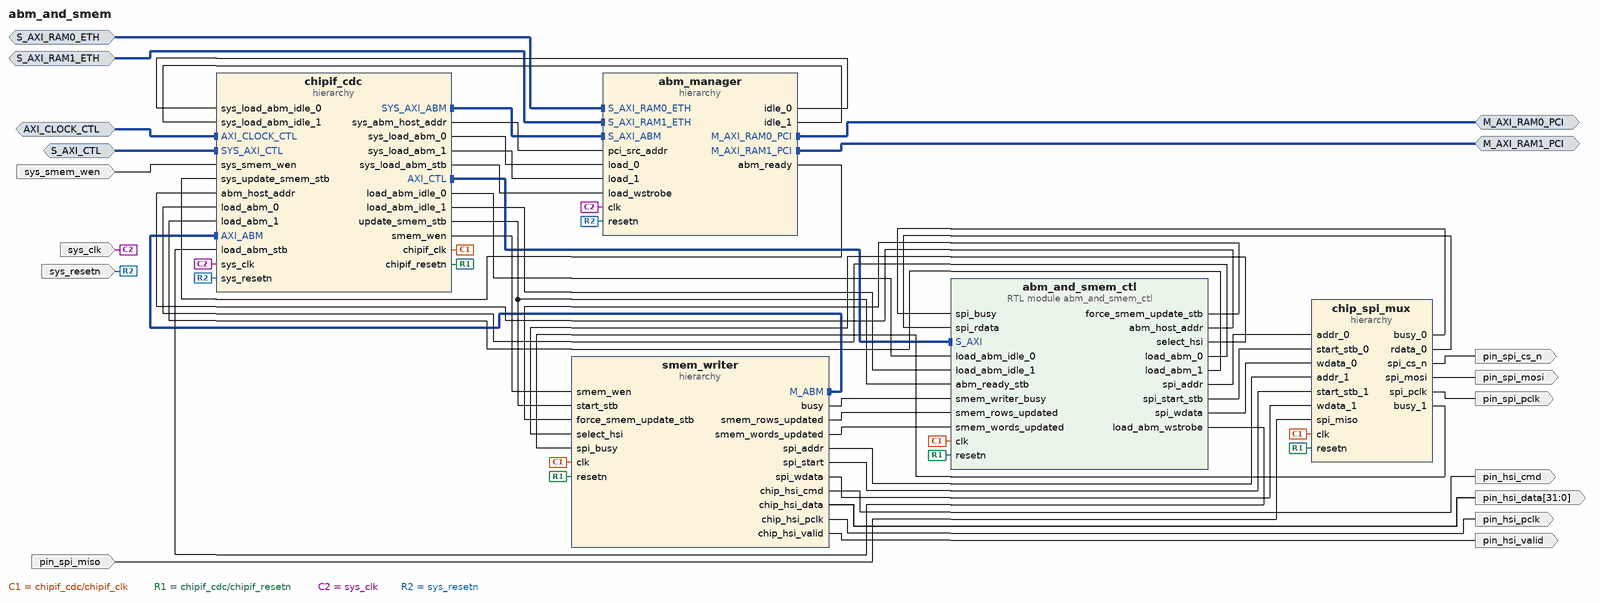
[diagram p0: block diagram of the top level]
# Vivado block design abm_and_smem, xcku15p-ffve1517-3-e, Vivado 2024.2
create_bd_design abm_and_smem

create_bd_intf_port -mode Slave -vlnv xilinx.com:interface:aximm_rtl:1.0 S_AXI_RAM0_ETH
set_property -dict [list \
  CONFIG.ADDR_WIDTH 64 \
  CONFIG.ARUSER_WIDTH 0 \
  CONFIG.AWUSER_WIDTH 0 \
  CONFIG.BUSER_WIDTH 0 \
  CONFIG.DATA_WIDTH 512 \
  CONFIG.FREQ_HZ 250000000 \
  CONFIG.HAS_BRESP 1 \
  CONFIG.HAS_BURST 1 \
  CONFIG.HAS_CACHE 1 \
  CONFIG.HAS_LOCK 1 \
  CONFIG.HAS_PROT 1 \
  CONFIG.HAS_QOS 1 \
  CONFIG.HAS_REGION 0 \
  CONFIG.HAS_RRESP 1 \
  CONFIG.HAS_WSTRB 1 \
  CONFIG.ID_WIDTH 4 \
  CONFIG.MAX_BURST_LENGTH 256 \
  CONFIG.NUM_READ_OUTSTANDING 2 \
  CONFIG.NUM_READ_THREADS 1 \
  CONFIG.NUM_WRITE_OUTSTANDING 2 \
  CONFIG.NUM_WRITE_THREADS 1 \
  CONFIG.PROTOCOL AXI4 \
  CONFIG.READ_WRITE_MODE READ_WRITE \
  CONFIG.RUSER_BITS_PER_BYTE 0 \
  CONFIG.RUSER_WIDTH 0 \
  CONFIG.SUPPORTS_NARROW_BURST 1 \
  CONFIG.WUSER_BITS_PER_BYTE 0 \
  CONFIG.WUSER_WIDTH 0 \
] [get_bd_intf_ports S_AXI_RAM0_ETH]
create_bd_intf_port -mode Master -vlnv xilinx.com:interface:aximm_rtl:1.0 M_AXI_RAM0_PCI
set_property -dict [list \
  CONFIG.ADDR_WIDTH 64 \
  CONFIG.DATA_WIDTH 512 \
  CONFIG.FREQ_HZ 250000000 \
  CONFIG.HAS_REGION 0 \
  CONFIG.NUM_READ_OUTSTANDING 2 \
  CONFIG.NUM_WRITE_OUTSTANDING 2 \
  CONFIG.PROTOCOL AXI4 \
] [get_bd_intf_ports M_AXI_RAM0_PCI]
create_bd_intf_port -mode Slave -vlnv xilinx.com:interface:aximm_rtl:1.0 S_AXI_RAM1_ETH
set_property -dict [list \
  CONFIG.ADDR_WIDTH 64 \
  CONFIG.ARUSER_WIDTH 0 \
  CONFIG.AWUSER_WIDTH 0 \
  CONFIG.BUSER_WIDTH 0 \
  CONFIG.DATA_WIDTH 512 \
  CONFIG.FREQ_HZ 250000000 \
  CONFIG.HAS_BRESP 1 \
  CONFIG.HAS_BURST 1 \
  CONFIG.HAS_CACHE 1 \
  CONFIG.HAS_LOCK 1 \
  CONFIG.HAS_PROT 1 \
  CONFIG.HAS_QOS 1 \
  CONFIG.HAS_REGION 0 \
  CONFIG.HAS_RRESP 1 \
  CONFIG.HAS_WSTRB 1 \
  CONFIG.ID_WIDTH 4 \
  CONFIG.MAX_BURST_LENGTH 256 \
  CONFIG.NUM_READ_OUTSTANDING 2 \
  CONFIG.NUM_READ_THREADS 1 \
  CONFIG.NUM_WRITE_OUTSTANDING 2 \
  CONFIG.NUM_WRITE_THREADS 1 \
  CONFIG.PROTOCOL AXI4 \
  CONFIG.READ_WRITE_MODE READ_WRITE \
  CONFIG.RUSER_BITS_PER_BYTE 0 \
  CONFIG.RUSER_WIDTH 0 \
  CONFIG.SUPPORTS_NARROW_BURST 1 \
  CONFIG.WUSER_BITS_PER_BYTE 0 \
  CONFIG.WUSER_WIDTH 0 \
] [get_bd_intf_ports S_AXI_RAM1_ETH]
create_bd_intf_port -mode Master -vlnv xilinx.com:interface:aximm_rtl:1.0 M_AXI_RAM1_PCI
set_property -dict [list \
  CONFIG.ADDR_WIDTH 64 \
  CONFIG.DATA_WIDTH 512 \
  CONFIG.FREQ_HZ 250000000 \
  CONFIG.HAS_REGION 0 \
  CONFIG.NUM_READ_OUTSTANDING 2 \
  CONFIG.NUM_WRITE_OUTSTANDING 2 \
  CONFIG.PROTOCOL AXI4 \
] [get_bd_intf_ports M_AXI_RAM1_PCI]
create_bd_intf_port -mode Slave -vlnv xilinx.com:interface:aximm_rtl:1.0 AXI_CLOCK_CTL
set_property -dict [list \
  CONFIG.ADDR_WIDTH 16 \
  CONFIG.ARUSER_WIDTH 0 \
  CONFIG.AWUSER_WIDTH 0 \
  CONFIG.BUSER_WIDTH 0 \
  CONFIG.DATA_WIDTH 32 \
  CONFIG.FREQ_HZ 250000000 \
  CONFIG.HAS_BRESP 1 \
  CONFIG.HAS_BURST 0 \
  CONFIG.HAS_CACHE 0 \
  CONFIG.HAS_LOCK 0 \
  CONFIG.HAS_PROT 1 \
  CONFIG.HAS_QOS 0 \
  CONFIG.HAS_REGION 0 \
  CONFIG.HAS_RRESP 1 \
  CONFIG.HAS_WSTRB 1 \
  CONFIG.ID_WIDTH 0 \
  CONFIG.NUM_READ_OUTSTANDING 1 \
  CONFIG.NUM_READ_THREADS 1 \
  CONFIG.NUM_WRITE_OUTSTANDING 1 \
  CONFIG.NUM_WRITE_THREADS 1 \
  CONFIG.PROTOCOL AXI4LITE \
  CONFIG.READ_WRITE_MODE READ_WRITE \
  CONFIG.RUSER_BITS_PER_BYTE 0 \
  CONFIG.RUSER_WIDTH 0 \
  CONFIG.WUSER_BITS_PER_BYTE 0 \
  CONFIG.WUSER_WIDTH 0 \
] [get_bd_intf_ports AXI_CLOCK_CTL]
create_bd_intf_port -mode Slave -vlnv xilinx.com:interface:aximm_rtl:1.0 S_AXI_CTL
set_property -dict [list \
  CONFIG.ADDR_WIDTH 16 \
  CONFIG.ARUSER_WIDTH 0 \
  CONFIG.AWUSER_WIDTH 0 \
  CONFIG.BUSER_WIDTH 0 \
  CONFIG.DATA_WIDTH 32 \
  CONFIG.FREQ_HZ 250000000 \
  CONFIG.HAS_BRESP 1 \
  CONFIG.HAS_BURST 0 \
  CONFIG.HAS_CACHE 0 \
  CONFIG.HAS_LOCK 0 \
  CONFIG.HAS_PROT 1 \
  CONFIG.HAS_QOS 0 \
  CONFIG.HAS_REGION 0 \
  CONFIG.HAS_RRESP 1 \
  CONFIG.HAS_WSTRB 1 \
  CONFIG.ID_WIDTH 0 \
  CONFIG.MAX_BURST_LENGTH 1 \
  CONFIG.NUM_READ_OUTSTANDING 1 \
  CONFIG.NUM_READ_THREADS 1 \
  CONFIG.NUM_WRITE_OUTSTANDING 1 \
  CONFIG.NUM_WRITE_THREADS 1 \
  CONFIG.PROTOCOL AXI4LITE \
  CONFIG.READ_WRITE_MODE READ_WRITE \
  CONFIG.RUSER_BITS_PER_BYTE 0 \
  CONFIG.RUSER_WIDTH 0 \
  CONFIG.SUPPORTS_NARROW_BURST 0 \
  CONFIG.WUSER_BITS_PER_BYTE 0 \
  CONFIG.WUSER_WIDTH 0 \
] [get_bd_intf_ports S_AXI_CTL]
create_bd_port -dir I -type clk sys_clk
set_property -dict [list \
  CONFIG.ASSOCIATED_BUSIF S_AXI_CTL:S_AXI_RAM0_ETH:M_AXI_RAM0_PCI:S_AXI_RAM1_ETH:M_AXI_RAM1_PCI:AXI_CLOCK_CTL \
  CONFIG.FREQ_HZ 250000000 \
] [get_bd_ports sys_clk]
create_bd_port -dir O pin_spi_cs_n
create_bd_port -dir I pin_spi_miso
create_bd_port -dir O pin_spi_mosi
create_bd_port -dir I sys_resetn
create_bd_port -dir I sys_smem_wen
create_bd_port -dir O pin_hsi_cmd
create_bd_port -dir O -type data pin_hsi_valid
create_bd_port -dir O -from 31 -to 0 -type data pin_hsi_data
create_bd_port -dir O -type data pin_hsi_pclk
create_bd_port -dir O pin_spi_pclk

create_bd_cell -type module -reference abm_and_smem_ctl abm_and_smem_ctl
create_bd_cell -type hier abm_manager
create_bd_cell -type hier chip_spi_mux
create_bd_cell -type hier smem_writer
create_bd_cell -type hier chipif_cdc

# ---- hierarchy /abm_manager ----
current_bd_instance /abm_manager
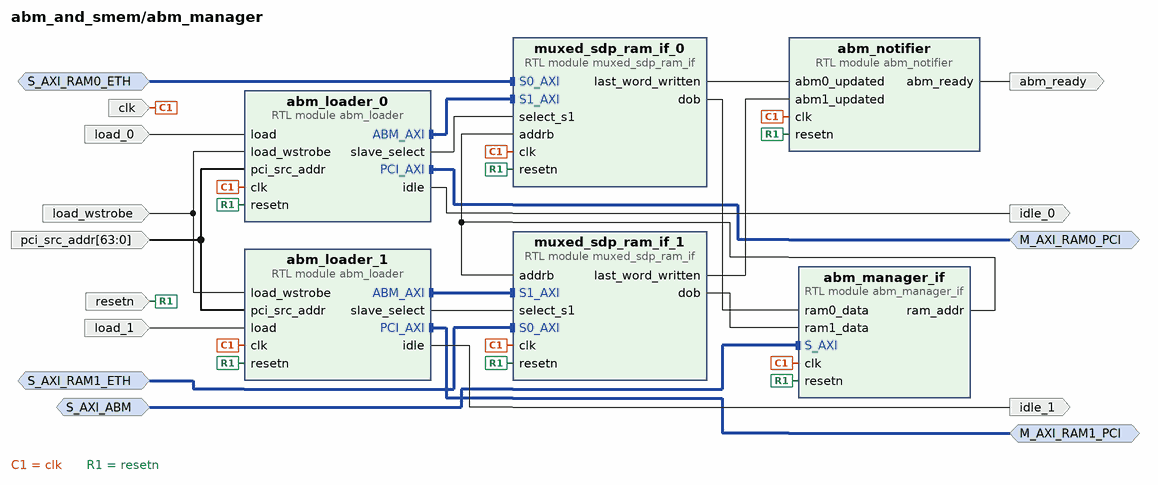
[diagram p1: block diagram inside /abm_manager]
create_bd_intf_pin -mode Slave -vlnv xilinx.com:interface:aximm_rtl:1.0 S_AXI_RAM1_ETH
create_bd_intf_pin -mode Slave -vlnv xilinx.com:interface:aximm_rtl:1.0 S_AXI_RAM0_ETH
create_bd_intf_pin -mode Slave -vlnv xilinx.com:interface:aximm_rtl:1.0 S_AXI_ABM
create_bd_intf_pin -mode Master -vlnv xilinx.com:interface:aximm_rtl:1.0 M_AXI_RAM1_PCI
create_bd_intf_pin -mode Master -vlnv xilinx.com:interface:aximm_rtl:1.0 M_AXI_RAM0_PCI
create_bd_pin -dir I clk
create_bd_pin -dir I resetn
create_bd_pin -dir I load_wstrobe
create_bd_pin -dir I load_1
create_bd_pin -dir I load_0
create_bd_pin -dir O idle_1
create_bd_pin -dir O idle_0
create_bd_pin -dir I -from 63 -to 0 pci_src_addr
create_bd_pin -dir O abm_ready

create_bd_cell -type module -reference abm_notifier abm_notifier
create_bd_cell -type module -reference muxed_sdp_ram_if muxed_sdp_ram_if_0
create_bd_cell -type module -reference muxed_sdp_ram_if muxed_sdp_ram_if_1
create_bd_cell -type module -reference abm_loader abm_loader_0
create_bd_cell -type module -reference abm_loader abm_loader_1
create_bd_cell -type module -reference abm_manager_if abm_manager_if

# ---- hierarchy /chip_spi_mux ----
current_bd_instance /chip_spi_mux
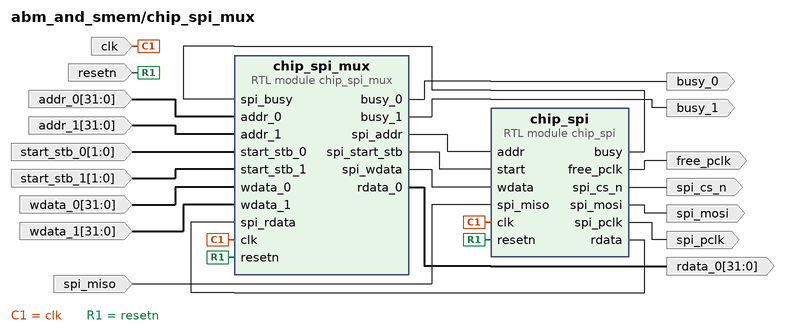
[diagram p2: block diagram inside /chip_spi_mux]
create_bd_pin -dir I clk
create_bd_pin -dir I resetn
create_bd_pin -dir I -from 31 -to 0 addr_0
create_bd_pin -dir I -from 31 -to 0 addr_1
create_bd_pin -dir I -from 31 -to 0 wdata_0
create_bd_pin -dir I -from 31 -to 0 wdata_1
create_bd_pin -dir O -from 31 -to 0 rdata_0
create_bd_pin -dir O busy_0
create_bd_pin -dir O busy_1
create_bd_pin -dir O spi_mosi
create_bd_pin -dir O spi_cs_n
create_bd_pin -dir I spi_miso
create_bd_pin -dir I -from 1 -to 0 start_stb_0
create_bd_pin -dir I -from 1 -to 0 start_stb_1
create_bd_pin -dir O free_pclk
create_bd_pin -dir O spi_pclk

create_bd_cell -type module -reference chip_spi chip_spi
create_bd_cell -type module -reference chip_spi_mux chip_spi_mux

# ---- hierarchy /smem_writer ----
current_bd_instance /smem_writer
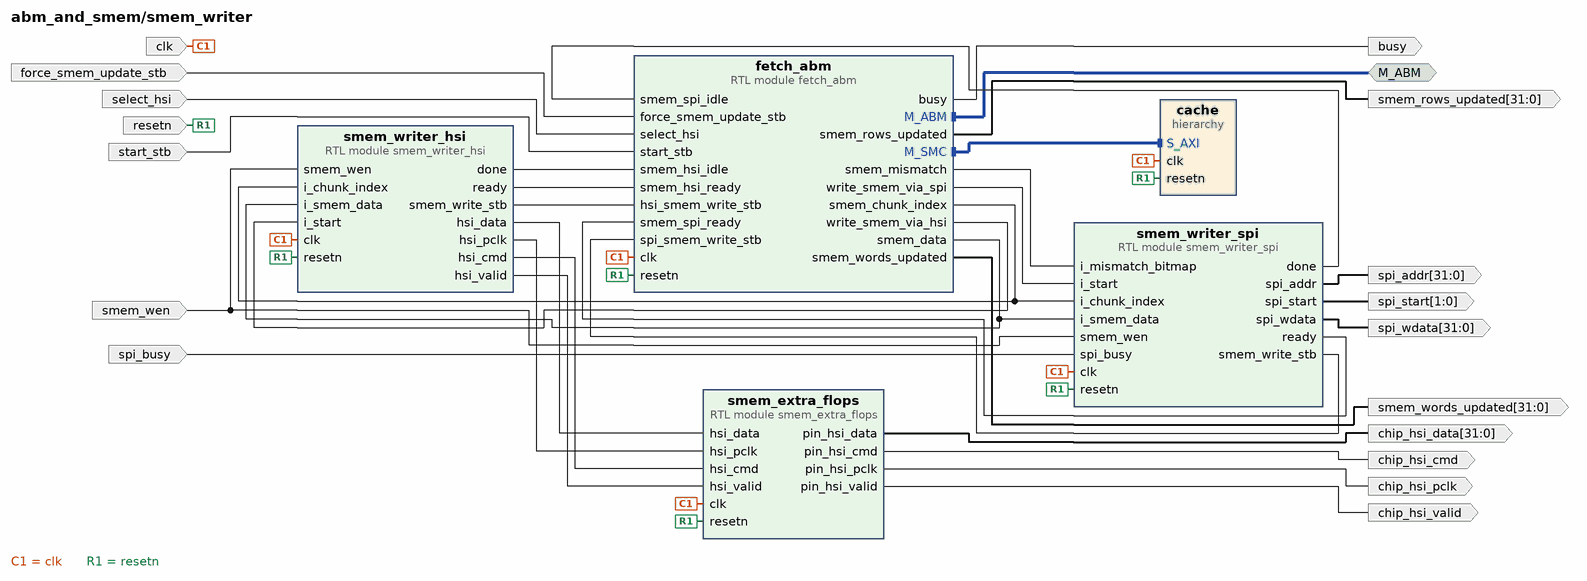
[diagram p3: block diagram inside /smem_writer]
create_bd_intf_pin -mode Master -vlnv xilinx.com:interface:aximm_rtl:1.0 M_ABM
create_bd_pin -dir I clk
create_bd_pin -dir I resetn
create_bd_pin -dir I start_stb
create_bd_pin -dir I select_hsi
create_bd_pin -dir I force_smem_update_stb
create_bd_pin -dir O -from 31 -to 0 spi_addr
create_bd_pin -dir O -from 31 -to 0 spi_wdata
create_bd_pin -dir O -from 1 -to 0 spi_start
create_bd_pin -dir I spi_busy
create_bd_pin -dir O -from 31 -to 0 smem_rows_updated
create_bd_pin -dir O -from 31 -to 0 smem_words_updated
create_bd_pin -dir O busy
create_bd_pin -dir I smem_wen
create_bd_pin -dir O chip_hsi_pclk
create_bd_pin -dir O -from 31 -to 0 chip_hsi_data
create_bd_pin -dir O chip_hsi_cmd
create_bd_pin -dir O chip_hsi_valid

create_bd_cell -type module -reference fetch_abm fetch_abm
set_property -dict {CONFIG.BRAM_SIZE 0x00100000} [get_bd_cells fetch_abm]
create_bd_cell -type hier cache
create_bd_cell -type module -reference smem_writer_spi smem_writer_spi
create_bd_cell -type module -reference smem_writer_hsi smem_writer_hsi
create_bd_cell -type module -reference smem_extra_flops smem_extra_flops

# ---- hierarchy /smem_writer/cache ----
current_bd_instance /smem_writer/cache
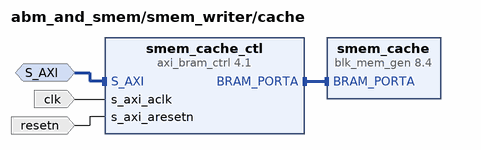
[diagram p4: block diagram inside /smem_writer/cache]
create_bd_intf_pin -mode Slave -vlnv xilinx.com:interface:aximm_rtl:1.0 S_AXI
create_bd_pin -dir I clk
create_bd_pin -dir I resetn

create_bd_cell -type ip -vlnv xilinx.com:ip:axi_bram_ctrl:4.1 smem_cache_ctl
set_property -dict {CONFIG.DATA_WIDTH 512 CONFIG.SINGLE_PORT_BRAM 1} [get_bd_cells smem_cache_ctl]
create_bd_cell -type ip -vlnv xilinx.com:ip:blk_mem_gen:8.4 smem_cache

# ---- hierarchy /chipif_cdc ----
current_bd_instance /chipif_cdc
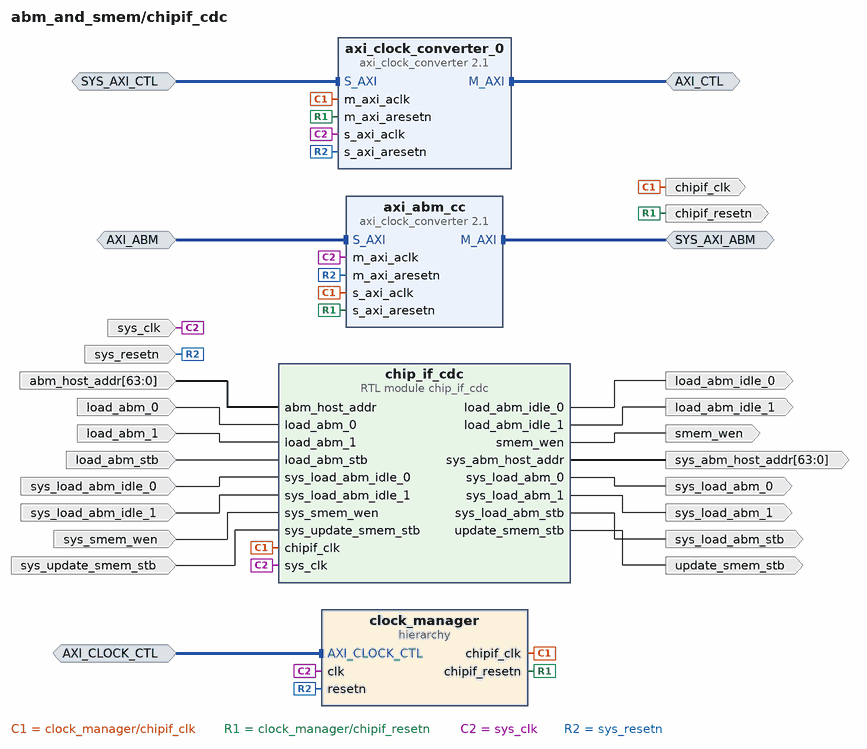
[diagram p5: block diagram inside /chipif_cdc]
create_bd_intf_pin -mode Slave -vlnv xilinx.com:interface:aximm_rtl:1.0 AXI_ABM
create_bd_intf_pin -mode Master -vlnv xilinx.com:interface:aximm_rtl:1.0 SYS_AXI_ABM
create_bd_intf_pin -mode Slave -vlnv xilinx.com:interface:aximm_rtl:1.0 SYS_AXI_CTL
create_bd_intf_pin -mode Master -vlnv xilinx.com:interface:aximm_rtl:1.0 AXI_CTL
create_bd_intf_pin -mode Slave -vlnv xilinx.com:interface:aximm_rtl:1.0 AXI_CLOCK_CTL
create_bd_pin -dir I sys_clk
create_bd_pin -dir I sys_resetn
create_bd_pin -dir I sys_update_smem_stb
create_bd_pin -dir I sys_smem_wen
create_bd_pin -dir I load_abm_stb
create_bd_pin -dir I load_abm_0
create_bd_pin -dir I load_abm_1
create_bd_pin -dir I sys_load_abm_idle_0
create_bd_pin -dir I sys_load_abm_idle_1
create_bd_pin -dir I -from 63 -to 0 abm_host_addr
create_bd_pin -dir O update_smem_stb
create_bd_pin -dir O smem_wen
create_bd_pin -dir O sys_load_abm_stb
create_bd_pin -dir O sys_load_abm_0
create_bd_pin -dir O sys_load_abm_1
create_bd_pin -dir O load_abm_idle_0
create_bd_pin -dir O load_abm_idle_1
create_bd_pin -dir O -from 63 -to 0 sys_abm_host_addr
create_bd_pin -dir O -type clk chipif_clk
create_bd_pin -dir O chipif_resetn

create_bd_cell -type module -reference chip_if_cdc chip_if_cdc
create_bd_cell -type ip -vlnv xilinx.com:ip:axi_clock_converter:2.1 axi_abm_cc
create_bd_cell -type ip -vlnv xilinx.com:ip:axi_clock_converter:2.1 axi_clock_converter_0
create_bd_cell -type hier clock_manager

# ---- hierarchy /chipif_cdc/clock_manager ----
current_bd_instance /chipif_cdc/clock_manager
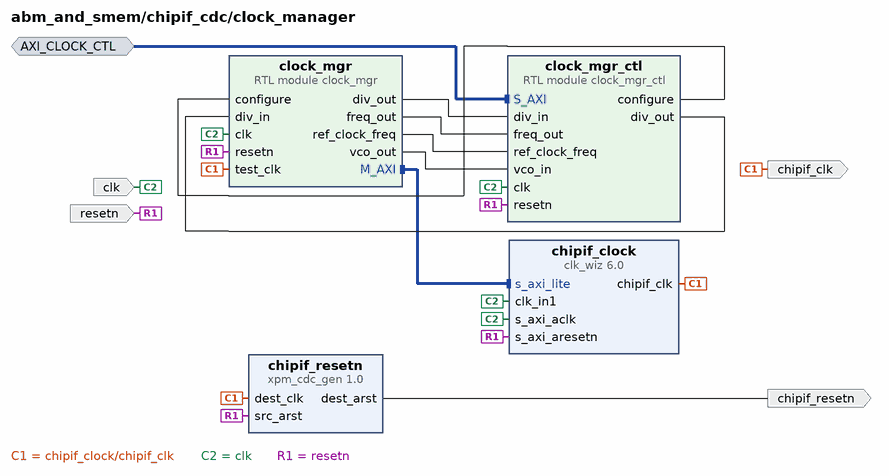
[diagram p6: block diagram inside /chipif_cdc/clock_manager]
create_bd_intf_pin -mode Slave -vlnv xilinx.com:interface:aximm_rtl:1.0 AXI_CLOCK_CTL
create_bd_pin -dir I clk
create_bd_pin -dir I resetn
create_bd_pin -dir O chipif_resetn
create_bd_pin -dir O -type clk chipif_clk

create_bd_cell -type module -reference clock_mgr clock_mgr
create_bd_cell -type module -reference clock_mgr_ctl clock_mgr_ctl
create_bd_cell -type ip -vlnv xilinx.com:ip:xpm_cdc_gen:1.0 chipif_resetn
set_property -dict {CONFIG.CDC_TYPE xpm_cdc_async_rst} [get_bd_cells chipif_resetn]
create_bd_cell -type ip -vlnv xilinx.com:ip:clk_wiz:6.0 chipif_clock
set_property -dict [list \
  CONFIG.CLKOUT1_JITTER 124.025 \
  CONFIG.CLKOUT1_PHASE_ERROR 154.678 \
  CONFIG.CLKOUT1_REQUESTED_OUT_FREQ 160 \
  CONFIG.CLK_OUT1_PORT chipif_clk \
  CONFIG.MMCM_CLKFBOUT_MULT_F 24.000 \
  CONFIG.MMCM_CLKOUT0_DIVIDE_F 7.500 \
  CONFIG.MMCM_DIVCLK_DIVIDE 5 \
  CONFIG.PRIM_SOURCE No_buffer \
  CONFIG.USE_DYN_RECONFIG true \
  CONFIG.USE_LOCKED true \
  CONFIG.USE_RESET true \
] [get_bd_cells chipif_clock]

# ---- connections ----

current_bd_instance /abm_manager
connect_bd_intf_net [get_bd_intf_pins S_AXI_ABM] [get_bd_intf_pins abm_manager_if/S_AXI]
connect_bd_intf_net [get_bd_intf_pins S_AXI_RAM0_ETH] [get_bd_intf_pins muxed_sdp_ram_if_0/S0_AXI]
connect_bd_intf_net [get_bd_intf_pins S_AXI_RAM1_ETH] [get_bd_intf_pins muxed_sdp_ram_if_1/S0_AXI]
connect_bd_intf_net [get_bd_intf_pins abm_loader_0/ABM_AXI] [get_bd_intf_pins muxed_sdp_ram_if_0/S1_AXI]
connect_bd_intf_net [get_bd_intf_pins M_AXI_RAM0_PCI] [get_bd_intf_pins abm_loader_0/PCI_AXI]
connect_bd_intf_net [get_bd_intf_pins abm_loader_1/ABM_AXI] [get_bd_intf_pins muxed_sdp_ram_if_1/S1_AXI]
connect_bd_intf_net [get_bd_intf_pins M_AXI_RAM1_PCI] [get_bd_intf_pins abm_loader_1/PCI_AXI]
connect_bd_net [get_bd_pins abm_loader_0/idle] [get_bd_pins idle_0]
connect_bd_net [get_bd_pins abm_loader_0/slave_select] [get_bd_pins muxed_sdp_ram_if_0/select_s1]
connect_bd_net [get_bd_pins abm_loader_1/idle] [get_bd_pins idle_1]
connect_bd_net [get_bd_pins abm_loader_1/slave_select] [get_bd_pins muxed_sdp_ram_if_1/select_s1]
connect_bd_net -net abm_manager_if_0_ram_addr [get_bd_pins abm_manager_if/ram_addr] \
  [get_bd_pins muxed_sdp_ram_if_0/addrb] [get_bd_pins muxed_sdp_ram_if_1/addrb]
connect_bd_net [get_bd_pins abm_notifier/abm_ready] [get_bd_pins abm_ready]
connect_bd_net [get_bd_pins clk] \
  [get_bd_pins abm_manager_if/clk] [get_bd_pins abm_notifier/clk] [get_bd_pins muxed_sdp_ram_if_0/clk] \
  [get_bd_pins muxed_sdp_ram_if_1/clk] [get_bd_pins abm_loader_0/clk] [get_bd_pins abm_loader_1/clk]
connect_bd_net -net load_0_1 [get_bd_pins load_0] [get_bd_pins abm_loader_0/load]
connect_bd_net -net load_1_1 [get_bd_pins load_1] [get_bd_pins abm_loader_1/load]
connect_bd_net [get_bd_pins load_wstrobe] [get_bd_pins abm_loader_0/load_wstrobe] [get_bd_pins abm_loader_1/load_wstrobe]
connect_bd_net [get_bd_pins muxed_sdp_ram_if_0/dob] [get_bd_pins abm_manager_if/ram0_data]
connect_bd_net [get_bd_pins muxed_sdp_ram_if_0/last_word_written] [get_bd_pins abm_notifier/abm0_updated]
connect_bd_net [get_bd_pins muxed_sdp_ram_if_1/dob] [get_bd_pins abm_manager_if/ram1_data]
connect_bd_net [get_bd_pins muxed_sdp_ram_if_1/last_word_written] [get_bd_pins abm_notifier/abm1_updated]
connect_bd_net [get_bd_pins pci_src_addr] [get_bd_pins abm_loader_0/pci_src_addr] [get_bd_pins abm_loader_1/pci_src_addr]
connect_bd_net [get_bd_pins resetn] \
  [get_bd_pins abm_manager_if/resetn] [get_bd_pins abm_notifier/resetn] [get_bd_pins muxed_sdp_ram_if_0/resetn] \
  [get_bd_pins muxed_sdp_ram_if_1/resetn] [get_bd_pins abm_loader_0/resetn] [get_bd_pins abm_loader_1/resetn]

current_bd_instance /chip_spi_mux
connect_bd_net [get_bd_pins clk] [get_bd_pins chip_spi_mux/clk] [get_bd_pins chip_spi/clk]
connect_bd_net -net addr_0_1 [get_bd_pins addr_0] [get_bd_pins chip_spi_mux/addr_0]
connect_bd_net -net addr_1_1 [get_bd_pins addr_1] [get_bd_pins chip_spi_mux/addr_1]
connect_bd_net [get_bd_pins chip_spi/busy] [get_bd_pins chip_spi_mux/spi_busy]
connect_bd_net [get_bd_pins chip_spi/free_pclk] [get_bd_pins free_pclk]
connect_bd_net [get_bd_pins chip_spi_mux/busy_0] [get_bd_pins busy_0]
connect_bd_net [get_bd_pins chip_spi_mux/busy_1] [get_bd_pins busy_1]
connect_bd_net [get_bd_pins chip_spi_mux/rdata_0] [get_bd_pins rdata_0]
connect_bd_net [get_bd_pins chip_spi_mux/spi_addr] [get_bd_pins chip_spi/addr]
connect_bd_net -net chip_spi_mux_spi_start [get_bd_pins chip_spi_mux/spi_start_stb] [get_bd_pins chip_spi/start]
connect_bd_net [get_bd_pins chip_spi_mux/spi_wdata] [get_bd_pins chip_spi/wdata]
connect_bd_net [get_bd_pins chip_spi/rdata] [get_bd_pins chip_spi_mux/spi_rdata]
connect_bd_net [get_bd_pins chip_spi/spi_cs_n] [get_bd_pins spi_cs_n]
connect_bd_net [get_bd_pins chip_spi/spi_mosi] [get_bd_pins spi_mosi]
connect_bd_net [get_bd_pins chip_spi/spi_pclk] [get_bd_pins spi_pclk]
connect_bd_net [get_bd_pins resetn] [get_bd_pins chip_spi_mux/resetn] [get_bd_pins chip_spi/resetn]
connect_bd_net [get_bd_pins spi_miso] [get_bd_pins chip_spi/spi_miso]
connect_bd_net -net start_stb_0_1 [get_bd_pins start_stb_0] [get_bd_pins chip_spi_mux/start_stb_0]
connect_bd_net -net start_stb_1_1 [get_bd_pins start_stb_1] [get_bd_pins chip_spi_mux/start_stb_1]
connect_bd_net -net wdata_0_1 [get_bd_pins wdata_0] [get_bd_pins chip_spi_mux/wdata_0]
connect_bd_net -net wdata_1_1 [get_bd_pins wdata_1] [get_bd_pins chip_spi_mux/wdata_1]

current_bd_instance /smem_writer
connect_bd_intf_net [get_bd_intf_pins M_ABM] [get_bd_intf_pins fetch_abm/M_ABM]
connect_bd_intf_net [get_bd_intf_pins cache/S_AXI] [get_bd_intf_pins fetch_abm/M_SMC]
connect_bd_net [get_bd_pins clk] \
  [get_bd_pins cache/clk] [get_bd_pins smem_writer_hsi/clk] [get_bd_pins smem_extra_flops/clk] \
  [get_bd_pins smem_writer_spi/clk] [get_bd_pins fetch_abm/clk]
connect_bd_net [get_bd_pins fetch_abm/busy] [get_bd_pins busy]
connect_bd_net [get_bd_pins fetch_abm/smem_chunk_index] [get_bd_pins smem_writer_hsi/i_chunk_index] [get_bd_pins smem_writer_spi/i_chunk_index]
connect_bd_net [get_bd_pins fetch_abm/smem_data] [get_bd_pins smem_writer_hsi/i_smem_data] [get_bd_pins smem_writer_spi/i_smem_data]
connect_bd_net [get_bd_pins fetch_abm/smem_mismatch] [get_bd_pins smem_writer_spi/i_mismatch_bitmap]
connect_bd_net [get_bd_pins fetch_abm/smem_rows_updated] [get_bd_pins smem_rows_updated]
connect_bd_net [get_bd_pins fetch_abm/smem_words_updated] [get_bd_pins smem_words_updated]
connect_bd_net [get_bd_pins fetch_abm/write_smem_via_hsi] [get_bd_pins smem_writer_hsi/i_start]
connect_bd_net [get_bd_pins fetch_abm/write_smem_via_spi] [get_bd_pins smem_writer_spi/i_start]
connect_bd_net -net force_smem_update_1 [get_bd_pins force_smem_update_stb] [get_bd_pins fetch_abm/force_smem_update_stb]
connect_bd_net -net hier_0_done [get_bd_pins smem_writer_hsi/done] [get_bd_pins fetch_abm/smem_hsi_idle]
connect_bd_net -net hier_0_ready [get_bd_pins smem_writer_hsi/ready] [get_bd_pins fetch_abm/smem_hsi_ready]
connect_bd_net [get_bd_pins resetn] \
  [get_bd_pins cache/resetn] [get_bd_pins smem_writer_hsi/resetn] [get_bd_pins smem_extra_flops/resetn] \
  [get_bd_pins smem_writer_spi/resetn] [get_bd_pins fetch_abm/resetn]
connect_bd_net [get_bd_pins select_hsi] [get_bd_pins fetch_abm/select_hsi]
connect_bd_net [get_bd_pins smem_extra_flops/pin_hsi_data] [get_bd_pins chip_hsi_data]
connect_bd_net [get_bd_pins smem_extra_flops/pin_hsi_pclk] [get_bd_pins chip_hsi_pclk]
connect_bd_net [get_bd_pins smem_wen] [get_bd_pins smem_writer_hsi/smem_wen] [get_bd_pins smem_writer_spi/smem_wen]
connect_bd_net -net smem_writer_hsi_0_smem_write_stb [get_bd_pins smem_writer_hsi/smem_write_stb] [get_bd_pins fetch_abm/hsi_smem_write_stb]
connect_bd_net -net smem_writer_hsi_chip_hsi_cmd [get_bd_pins smem_extra_flops/pin_hsi_cmd] [get_bd_pins chip_hsi_cmd]
connect_bd_net -net smem_writer_hsi_chip_hsi_data [get_bd_pins smem_writer_hsi/hsi_data] [get_bd_pins smem_extra_flops/hsi_data]
connect_bd_net -net smem_writer_hsi_chip_hsi_pclk [get_bd_pins smem_writer_hsi/hsi_pclk] [get_bd_pins smem_extra_flops/hsi_pclk]
connect_bd_net -net smem_writer_hsi_chip_hsi_valid [get_bd_pins smem_extra_flops/pin_hsi_valid] [get_bd_pins chip_hsi_valid]
connect_bd_net [get_bd_pins smem_writer_hsi/hsi_cmd] [get_bd_pins smem_extra_flops/hsi_cmd]
connect_bd_net [get_bd_pins smem_writer_hsi/hsi_valid] [get_bd_pins smem_extra_flops/hsi_valid]
connect_bd_net [get_bd_pins smem_writer_spi/done] [get_bd_pins fetch_abm/smem_spi_idle]
connect_bd_net [get_bd_pins smem_writer_spi/ready] [get_bd_pins fetch_abm/smem_spi_ready]
connect_bd_net [get_bd_pins smem_writer_spi/smem_write_stb] [get_bd_pins fetch_abm/spi_smem_write_stb]
connect_bd_net [get_bd_pins smem_writer_spi/spi_addr] [get_bd_pins spi_addr]
connect_bd_net [get_bd_pins smem_writer_spi/spi_start] [get_bd_pins spi_start]
connect_bd_net [get_bd_pins smem_writer_spi/spi_wdata] [get_bd_pins spi_wdata]
connect_bd_net [get_bd_pins spi_busy] [get_bd_pins smem_writer_spi/spi_busy]
connect_bd_net -net start_1 [get_bd_pins start_stb] [get_bd_pins fetch_abm/start_stb]

current_bd_instance /smem_writer/cache
connect_bd_intf_net -intf_net axi_bram_ctrl_0_BRAM_PORTA [get_bd_intf_pins smem_cache_ctl/BRAM_PORTA] [get_bd_intf_pins smem_cache/BRAM_PORTA]
connect_bd_intf_net -intf_net fetch_abm_M_SMC [get_bd_intf_pins S_AXI] [get_bd_intf_pins smem_cache_ctl/S_AXI]
connect_bd_net [get_bd_pins clk] [get_bd_pins smem_cache_ctl/s_axi_aclk]
connect_bd_net [get_bd_pins resetn] [get_bd_pins smem_cache_ctl/s_axi_aresetn]

current_bd_instance /chipif_cdc
connect_bd_intf_net [get_bd_intf_pins clock_manager/AXI_CLOCK_CTL] [get_bd_intf_pins AXI_CLOCK_CTL]
connect_bd_intf_net -intf_net SYS_AXI_ABM_1 [get_bd_intf_pins AXI_ABM] [get_bd_intf_pins axi_abm_cc/S_AXI]
connect_bd_intf_net -intf_net S_AXI_CTL_1 [get_bd_intf_pins SYS_AXI_CTL] [get_bd_intf_pins axi_clock_converter_0/S_AXI]
connect_bd_intf_net -intf_net axi_clock_converter_0_M_AXI [get_bd_intf_pins SYS_AXI_ABM] [get_bd_intf_pins axi_abm_cc/M_AXI]
connect_bd_intf_net [get_bd_intf_pins AXI_CTL] [get_bd_intf_pins axi_clock_converter_0/M_AXI]
connect_bd_net [get_bd_pins abm_host_addr] [get_bd_pins chip_if_cdc/abm_host_addr]
connect_bd_net [get_bd_pins chip_if_cdc/load_abm_idle_0] [get_bd_pins load_abm_idle_0]
connect_bd_net [get_bd_pins chip_if_cdc/load_abm_idle_1] [get_bd_pins load_abm_idle_1]
connect_bd_net [get_bd_pins chip_if_cdc/smem_wen] [get_bd_pins smem_wen]
connect_bd_net [get_bd_pins chip_if_cdc/sys_abm_host_addr] [get_bd_pins sys_abm_host_addr]
connect_bd_net [get_bd_pins chip_if_cdc/sys_load_abm_0] [get_bd_pins sys_load_abm_0]
connect_bd_net [get_bd_pins chip_if_cdc/sys_load_abm_1] [get_bd_pins sys_load_abm_1]
connect_bd_net [get_bd_pins chip_if_cdc/sys_load_abm_stb] [get_bd_pins sys_load_abm_stb]
connect_bd_net [get_bd_pins chip_if_cdc/update_smem_stb] [get_bd_pins update_smem_stb]
connect_bd_net -net chipif_clock_chipif_clk [get_bd_pins clock_manager/chipif_clk] \
  [get_bd_pins axi_abm_cc/s_axi_aclk] [get_bd_pins axi_clock_converter_0/m_axi_aclk] [get_bd_pins chip_if_cdc/chipif_clk] \
  [get_bd_pins chipif_clk]
connect_bd_net [get_bd_pins clock_manager/chipif_resetn] \
  [get_bd_pins axi_abm_cc/s_axi_aresetn] [get_bd_pins axi_clock_converter_0/m_axi_aresetn] [get_bd_pins chipif_resetn]
connect_bd_net -net load_abm_0_1 [get_bd_pins load_abm_0] [get_bd_pins chip_if_cdc/load_abm_0]
connect_bd_net -net load_abm_1_1 [get_bd_pins load_abm_1] [get_bd_pins chip_if_cdc/load_abm_1]
connect_bd_net [get_bd_pins load_abm_stb] [get_bd_pins chip_if_cdc/load_abm_stb]
connect_bd_net [get_bd_pins sys_clk] \
  [get_bd_pins axi_abm_cc/m_axi_aclk] [get_bd_pins axi_clock_converter_0/s_axi_aclk] [get_bd_pins chip_if_cdc/sys_clk] \
  [get_bd_pins clock_manager/clk]
connect_bd_net -net sys_load_abm_idle_0_1 [get_bd_pins sys_load_abm_idle_0] [get_bd_pins chip_if_cdc/sys_load_abm_idle_0]
connect_bd_net -net sys_load_abm_idle_1_1 [get_bd_pins sys_load_abm_idle_1] [get_bd_pins chip_if_cdc/sys_load_abm_idle_1]
connect_bd_net [get_bd_pins sys_resetn] \
  [get_bd_pins axi_abm_cc/m_axi_aresetn] [get_bd_pins axi_clock_converter_0/s_axi_aresetn] [get_bd_pins clock_manager/resetn]
connect_bd_net [get_bd_pins sys_smem_wen] [get_bd_pins chip_if_cdc/sys_smem_wen]
connect_bd_net [get_bd_pins sys_update_smem_stb] [get_bd_pins chip_if_cdc/sys_update_smem_stb]

current_bd_instance /chipif_cdc/clock_manager
connect_bd_intf_net [get_bd_intf_pins AXI_CLOCK_CTL] [get_bd_intf_pins clock_mgr_ctl/S_AXI]
connect_bd_intf_net [get_bd_intf_pins clock_mgr/M_AXI] [get_bd_intf_pins chipif_clock/s_axi_lite]
connect_bd_net -net chip_resetn_dest_arst [get_bd_pins chipif_resetn/dest_arst] [get_bd_pins chipif_resetn]
connect_bd_net [get_bd_pins chipif_clock/chipif_clk] [get_bd_pins chipif_resetn/dest_clk] [get_bd_pins clock_mgr/test_clk] [get_bd_pins chipif_clk]
connect_bd_net [get_bd_pins clk] \
  [get_bd_pins clock_mgr/clk] [get_bd_pins chipif_clock/clk_in1] [get_bd_pins chipif_clock/s_axi_aclk] \
  [get_bd_pins clock_mgr_ctl/clk]
connect_bd_net -net clock_mgr_0_div_out [get_bd_pins clock_mgr/div_out] [get_bd_pins clock_mgr_ctl/div_in]
connect_bd_net -net clock_mgr_0_freq_out [get_bd_pins clock_mgr/freq_out] [get_bd_pins clock_mgr_ctl/freq_out]
connect_bd_net -net clock_mgr_0_ref_clock_freq [get_bd_pins clock_mgr/ref_clock_freq] [get_bd_pins clock_mgr_ctl/ref_clock_freq]
connect_bd_net -net clock_mgr_0_vco_out [get_bd_pins clock_mgr/vco_out] [get_bd_pins clock_mgr_ctl/vco_in]
connect_bd_net [get_bd_pins clock_mgr_ctl/configure] [get_bd_pins clock_mgr/configure]
connect_bd_net [get_bd_pins clock_mgr_ctl/div_out] [get_bd_pins clock_mgr/div_in]
connect_bd_net [get_bd_pins resetn] \
  [get_bd_pins clock_mgr/resetn] [get_bd_pins chipif_resetn/src_arst] [get_bd_pins chipif_clock/s_axi_aresetn] \
  [get_bd_pins clock_mgr_ctl/resetn]

current_bd_instance /
connect_bd_intf_net [get_bd_intf_pins chipif_cdc/AXI_ABM] [get_bd_intf_pins smem_writer/M_ABM]
connect_bd_intf_net [get_bd_intf_ports AXI_CLOCK_CTL] [get_bd_intf_pins chipif_cdc/AXI_CLOCK_CTL]
connect_bd_intf_net [get_bd_intf_pins abm_manager/S_AXI_ABM] [get_bd_intf_pins chipif_cdc/SYS_AXI_ABM]
connect_bd_intf_net [get_bd_intf_ports S_AXI_CTL] [get_bd_intf_pins chipif_cdc/SYS_AXI_CTL]
connect_bd_intf_net [get_bd_intf_ports S_AXI_RAM0_ETH] [get_bd_intf_pins abm_manager/S_AXI_RAM0_ETH]
connect_bd_intf_net [get_bd_intf_ports S_AXI_RAM1_ETH] [get_bd_intf_pins abm_manager/S_AXI_RAM1_ETH]
connect_bd_intf_net [get_bd_intf_pins chipif_cdc/AXI_CTL] [get_bd_intf_pins abm_and_smem_ctl/S_AXI]
connect_bd_intf_net -intf_net smem_manager_S_AXI_RAM0_PCI [get_bd_intf_ports M_AXI_RAM0_PCI] [get_bd_intf_pins abm_manager/M_AXI_RAM0_PCI]
connect_bd_intf_net -intf_net smem_manager_S_AXI_RAM1_PCI [get_bd_intf_ports M_AXI_RAM1_PCI] [get_bd_intf_pins abm_manager/M_AXI_RAM1_PCI]
connect_bd_net [get_bd_pins abm_and_smem_ctl/abm_host_addr] [get_bd_pins chipif_cdc/abm_host_addr]
connect_bd_net [get_bd_pins abm_and_smem_ctl/spi_addr] [get_bd_pins chip_spi_mux/addr_0]
connect_bd_net [get_bd_pins abm_and_smem_ctl/spi_start_stb] [get_bd_pins chip_spi_mux/start_stb_0]
connect_bd_net [get_bd_pins abm_and_smem_ctl/spi_wdata] [get_bd_pins chip_spi_mux/wdata_0]
connect_bd_net -net chip_spi_busy_0 [get_bd_pins chip_spi_mux/busy_0] [get_bd_pins abm_and_smem_ctl/spi_busy]
connect_bd_net [get_bd_pins chip_spi_mux/spi_cs_n] [get_bd_ports pin_spi_cs_n]
connect_bd_net [get_bd_pins chip_spi_mux/spi_mosi] [get_bd_ports pin_spi_mosi]
connect_bd_net [get_bd_pins chip_spi_mux/spi_pclk] [get_bd_ports pin_spi_pclk]
connect_bd_net -net chip_spi_rdata_0 [get_bd_pins chip_spi_mux/rdata_0] [get_bd_pins abm_and_smem_ctl/spi_rdata]
connect_bd_net [get_bd_pins chipif_cdc/load_abm_idle_0] [get_bd_pins abm_and_smem_ctl/load_abm_idle_0]
connect_bd_net [get_bd_pins chipif_cdc/load_abm_idle_1] [get_bd_pins abm_and_smem_ctl/load_abm_idle_1]
connect_bd_net [get_bd_pins chipif_cdc/smem_wen] [get_bd_pins smem_writer/smem_wen]
connect_bd_net [get_bd_pins chipif_cdc/sys_abm_host_addr] [get_bd_pins abm_manager/pci_src_addr]
connect_bd_net [get_bd_pins chipif_cdc/sys_load_abm_0] [get_bd_pins abm_manager/load_0]
connect_bd_net [get_bd_pins chipif_cdc/sys_load_abm_1] [get_bd_pins abm_manager/load_1]
connect_bd_net [get_bd_pins chipif_cdc/sys_load_abm_stb] [get_bd_pins abm_manager/load_wstrobe]
connect_bd_net [get_bd_pins chipif_cdc/update_smem_stb] [get_bd_pins smem_writer/start_stb] [get_bd_pins abm_and_smem_ctl/abm_ready_stb]
connect_bd_net -net chipif_clock_chipif_clk [get_bd_pins chipif_cdc/chipif_clk] \
  [get_bd_pins smem_writer/clk] [get_bd_pins chip_spi_mux/clk] [get_bd_pins abm_and_smem_ctl/clk]
connect_bd_net -net clock_manager_chipif_resetn [get_bd_pins chipif_cdc/chipif_resetn] \
  [get_bd_pins smem_writer/resetn] [get_bd_pins chip_spi_mux/resetn] [get_bd_pins abm_and_smem_ctl/resetn]
connect_bd_net -net ext_spi_miso_1 [get_bd_ports pin_spi_miso] [get_bd_pins chip_spi_mux/spi_miso]
connect_bd_net -net force_smem_update_1 [get_bd_pins abm_and_smem_ctl/force_smem_update_stb] [get_bd_pins smem_writer/force_smem_update_stb]
connect_bd_net -net load_abm_0_1 [get_bd_pins abm_and_smem_ctl/load_abm_0] [get_bd_pins chipif_cdc/load_abm_0]
connect_bd_net -net load_abm_1_1 [get_bd_pins abm_and_smem_ctl/load_abm_1] [get_bd_pins chipif_cdc/load_abm_1]
connect_bd_net -net load_abm_stb_1 [get_bd_pins abm_and_smem_ctl/load_abm_wstrobe] [get_bd_pins chipif_cdc/load_abm_stb]
connect_bd_net -net pcie_bridge_0_axi_aclk [get_bd_ports sys_clk] [get_bd_pins abm_manager/clk] [get_bd_pins chipif_cdc/sys_clk]
connect_bd_net -net pcie_bridge_0_axi_aresetn [get_bd_ports sys_resetn] [get_bd_pins abm_manager/resetn] [get_bd_pins chipif_cdc/sys_resetn]
connect_bd_net -net select_hsi_1 [get_bd_pins abm_and_smem_ctl/select_hsi] [get_bd_pins smem_writer/select_hsi]
connect_bd_net [get_bd_pins smem_writer/busy] [get_bd_pins abm_and_smem_ctl/smem_writer_busy]
connect_bd_net [get_bd_pins smem_writer/chip_hsi_cmd] [get_bd_ports pin_hsi_cmd]
connect_bd_net [get_bd_pins smem_writer/chip_hsi_data] [get_bd_ports pin_hsi_data]
connect_bd_net [get_bd_pins smem_writer/chip_hsi_pclk] [get_bd_ports pin_hsi_pclk]
connect_bd_net [get_bd_pins smem_writer/chip_hsi_valid] [get_bd_ports pin_hsi_valid]
connect_bd_net [get_bd_pins smem_writer/smem_rows_updated] [get_bd_pins abm_and_smem_ctl/smem_rows_updated]
connect_bd_net [get_bd_pins smem_writer/smem_words_updated] [get_bd_pins abm_and_smem_ctl/smem_words_updated]
connect_bd_net [get_bd_pins smem_writer/spi_addr] [get_bd_pins chip_spi_mux/addr_1]
connect_bd_net [get_bd_pins smem_writer/spi_start] [get_bd_pins chip_spi_mux/start_stb_1]
connect_bd_net [get_bd_pins smem_writer/spi_wdata] [get_bd_pins chip_spi_mux/wdata_1]
connect_bd_net -net spi_busy_1 [get_bd_pins chip_spi_mux/busy_1] [get_bd_pins smem_writer/spi_busy]
connect_bd_net -net sys_load_abm_idle_0_1 [get_bd_pins abm_manager/idle_0] [get_bd_pins chipif_cdc/sys_load_abm_idle_0]
connect_bd_net -net sys_load_abm_idle_1_1 [get_bd_pins abm_manager/idle_1] [get_bd_pins chipif_cdc/sys_load_abm_idle_1]
connect_bd_net [get_bd_ports sys_smem_wen] [get_bd_pins chipif_cdc/sys_smem_wen]
connect_bd_net -net sys_update_smem_stb_1 [get_bd_pins abm_manager/abm_ready] [get_bd_pins chipif_cdc/sys_update_smem_stb]

# ---- address map ----
assign_bd_address -offset 0x0000000000000000 -range 1M -target_address_space [get_bd_addr_spaces abm_manager/abm_loader_0/ABM_AXI] [get_bd_addr_segs abm_manager/muxed_sdp_ram_if_0/S1_AXI/reg0]
assign_bd_address -offset 0x0000000000000000 -range 16E -target_address_space [get_bd_addr_spaces abm_manager/abm_loader_0/PCI_AXI] [get_bd_addr_segs M_AXI_RAM0_PCI/Reg]
assign_bd_address -offset 0x0000000000000000 -range 1M -target_address_space [get_bd_addr_spaces abm_manager/abm_loader_1/ABM_AXI] [get_bd_addr_segs abm_manager/muxed_sdp_ram_if_1/S1_AXI/reg0]
assign_bd_address -offset 0x0000000000000000 -range 16E -target_address_space [get_bd_addr_spaces abm_manager/abm_loader_1/PCI_AXI] [get_bd_addr_segs M_AXI_RAM1_PCI/Reg]
assign_bd_address -offset 0x0000 -range 4K -target_address_space [get_bd_addr_spaces AXI_CLOCK_CTL] [get_bd_addr_segs chipif_cdc/clock_manager/clock_mgr_ctl/S_AXI/reg0]
assign_bd_address -offset 0x000 -range 4K -target_address_space [get_bd_addr_spaces chipif_cdc/clock_manager/clock_mgr/M_AXI] [get_bd_addr_segs chipif_cdc/clock_manager/chipif_clock/s_axi_lite/Reg]
assign_bd_address -offset 0x1000 -range 256 -target_address_space [get_bd_addr_spaces S_AXI_CTL] [get_bd_addr_segs abm_and_smem_ctl/S_AXI/reg0]
assign_bd_address -offset 0x0000000000000000 -range 1M -target_address_space [get_bd_addr_spaces S_AXI_RAM0_ETH] [get_bd_addr_segs abm_manager/muxed_sdp_ram_if_0/S0_AXI/reg0]
assign_bd_address -offset 0x0000000000000000 -range 1M -target_address_space [get_bd_addr_spaces S_AXI_RAM1_ETH] [get_bd_addr_segs abm_manager/muxed_sdp_ram_if_1/S0_AXI/reg0]
assign_bd_address -offset 0x00000 -range 1M -target_address_space [get_bd_addr_spaces smem_writer/fetch_abm/M_ABM] [get_bd_addr_segs abm_manager/abm_manager_if/S_AXI/reg0]
assign_bd_address -offset 0x00000 -range 1M -target_address_space [get_bd_addr_spaces smem_writer/fetch_abm/M_SMC] [get_bd_addr_segs smem_writer/cache/smem_cache_ctl/S_AXI/Mem0]

validate_bd_design
save_bd_design
